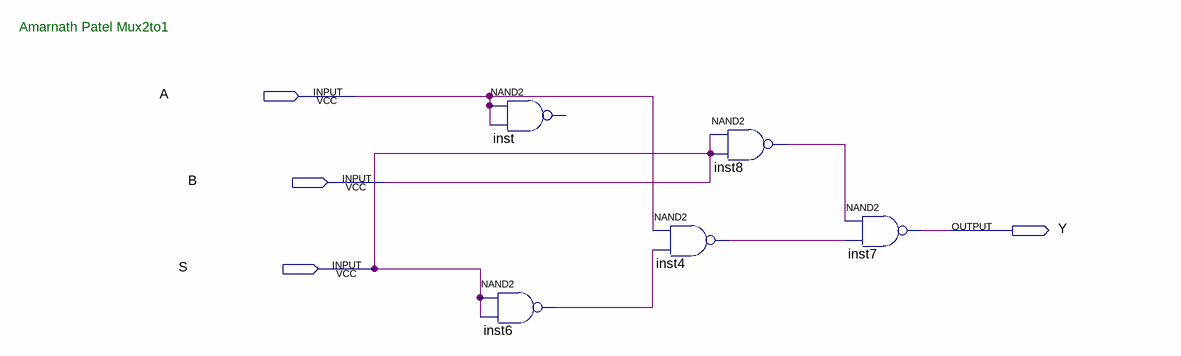
[diagram p0: schematic sheet]
// Quartus schematic Mux2to1_AmarnathPatelBDF.bdf as structural Verilog: 5 symbols, 4 pins
module Mux2to1_AmarnathPatelBDF (
  input  A,
  input  B,
  input  S,
  output Y
);

  wire inst4_out, inst6_out, inst8_out;

  // NAND2 inst has open pins: IN1=A, IN2=A, OUT=open
  nand inst6 (inst6_out, B, B);
  nand inst4 (inst4_out, A, inst6_out);
  nand inst8 (inst8_out, B, B);
  nand inst7 (Y, inst8_out, inst4_out);

  assign S = B;

  // Notes on the sheet:
  //   Amarnath Patel Mux2to1
endmodule
